# EAGLE design DoubleLna (EAGLE 9.6.2)
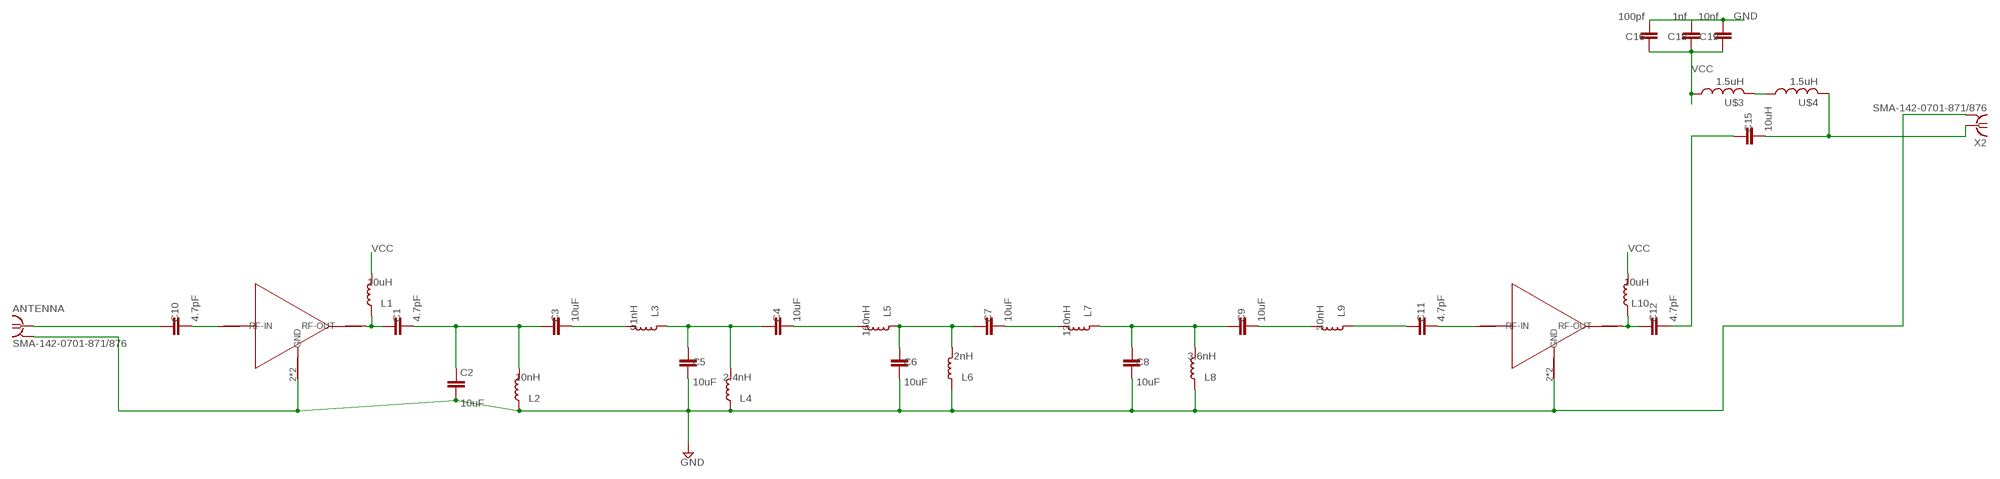
[diagram p0: schematic, sheet 1]

## Parts
ANTENNA  SMA-142-0701-871/876  [J502-ND-142-0701-871/876]
C1  4.7pF  10UF-0603-6.3V-20%  [0603]
C2  10uF  10UF-0603-6.3V-20%  [0603]
C3  10uF  10UF-0603-6.3V-20%  [0603]
C4  10uF  10UF-0603-6.3V-20%  [0603]
C5  10uF  10UF-0603-6.3V-20%  [0603]
C6  10uF  10UF-0603-6.3V-20%  [0603]
C7  10uF  10UF-0603-6.3V-20%  [0603]
C8  10uF  10UF-0603-6.3V-20%  [0603]
C9  10uF  10UF-0603-6.3V-20%  [0603]
C10  4.7pF  10UF-0603-6.3V-20%  [0603]
C11  4.7pF  10UF-0603-6.3V-20%  [0603]
C12  4.7pF  10UF-0603-6.3V-20%  [0603]
C15  10uH  10UF-0603-6.3V-20%  [0603]
C16  100pf  10UF-0603-6.3V-20%  [0603]
C18  1nf  10UF-0603-6.3V-20%  [0603]
C19  10nf  10UF-0603-6.3V-20%  [0603]
L1  10uH  L_0603  [L0603]
L2  10nH  L_0603  [L0603]
L3  91nH  L_0603  [L0603]
L4  2.4nH  L_0603  [L0603]
L5  160nH  L_0603  [L0603]
L6  2nH  L_0603  [L0603]
L7  130nH  L_0603  [L0603]
L8  3.6nH  L_0603  [L0603]
L9  30nH  L_0603  [L0603]
L10  10uH  L_0603  [L0603]
U$1  PSA4-5043+  [PSA4-5043+]
U$2  PSA4-5043+  [PSA4-5043+]
U$3  1.5uH  L504  [C0504]
U$4  1.5uH  L504  [C0504]
X2  SMA-142-0701-871/876  [J502-ND-142-0701-871/876]

## Nets
GND: ANTENNA.G@1 ANTENNA.G@2 ANTENNA.G@3 ANTENNA.G@4 C2.2 C5.2 C6.2 C8.2 C16.2 C18.2 C19.2 L2.2 L4.2 L6.2 L8.2 U$1.2(GND) U$1.4(GND) U$2.2(GND) U$2.4(GND) X2.G@1 X2.G@2 X2.G@3 X2.G@4
N$1: ANTENNA.1 C10.1
N$2: C1.2 C2.1 C3.1 L2.1
N$3: C3.2 L3.1
N$4: C4.1 C5.1 L3.2 L4.1
N$5: C4.2 L5.1
N$6: C6.1 C7.1 L5.2 L6.1
N$7: C7.2 L7.1
N$8: C8.1 C9.1 L7.2 L8.1
N$9: C9.2 L9.1
N$10: C10.2 U$1.3(RF-IN)
N$11: C1.1 L1.2 U$1.1(RF-OUT)
N$12: C12.1 L10.2 U$2.1(RF-OUT)
N$13: C11.2 U$2.3(RF-IN)
N$14: C12.2 C15.1
N$16: C11.1 L9.2
N$21: C15.2 U$4.2 X2.1
N$22: U$3.2 U$4.1
VCC: C16.1 C18.1 C19.1 L1.1 L10.1 U$3.1

## Library data of the parts
ANTENNA X2 = con-coax:SMA-: SMA 50 Ohm End Launch Jack Receptacle - Round Contact Johnson Components Source: www.johnsoncomponents.com .. J502-ND.pdf; MF: JOHNSON COMPONENTS; MPN: 142-0701-871; OC_FARNELL: 1339835; OC_NEWARK: 91B6105
C1 C10-C12 C15 C16 C18 C19 = SparkFun-Capacitors:10UF: 10.0µF ceramic capacitors A capacitor is a passive two-terminal electrical component used to store electrical energy temporarily in an electric field.; PROD_ID: CAP-11015; VALUE: 10uF
C2-C9 = SparkFun-Capacitors:10UF: 10.0µF ceramic capacitors A capacitor is a passive two-terminal electrical component used to store electrical energy temporarily in an electric field.; PROD_ID: CAP-11015
L1-L10 = rc-master-smd:L_: INDUCTOR
U$1 U$2 = PSA4-5043_:PSA4-5043+; AVAILABILITY: Unavailable; DESCRIPTION: Ultra Low Noise MMIC Amplifier, 50ohm, 0.05 to 4 GHz; MF: Mini-Circuits; MP: PSA4-5043+; PACKAGE: None; PRICE: None
U$3 U$4 = rcl-2:L504

## Net classes
0 default: width 0.305 mm, clearance 0.076 mm

## Board
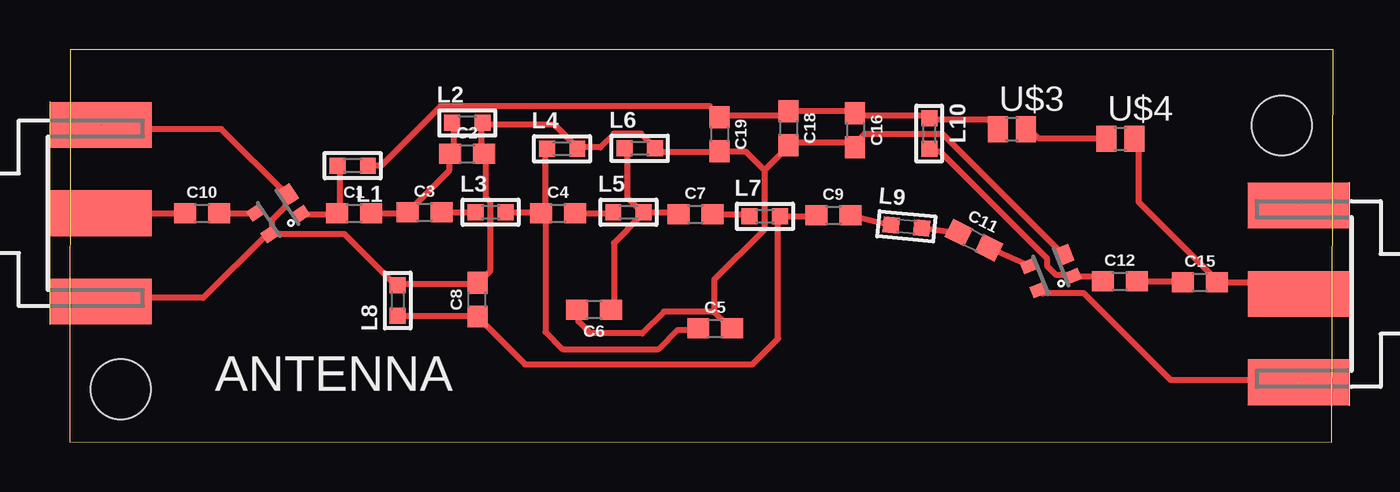
[diagram p1: board, top side]
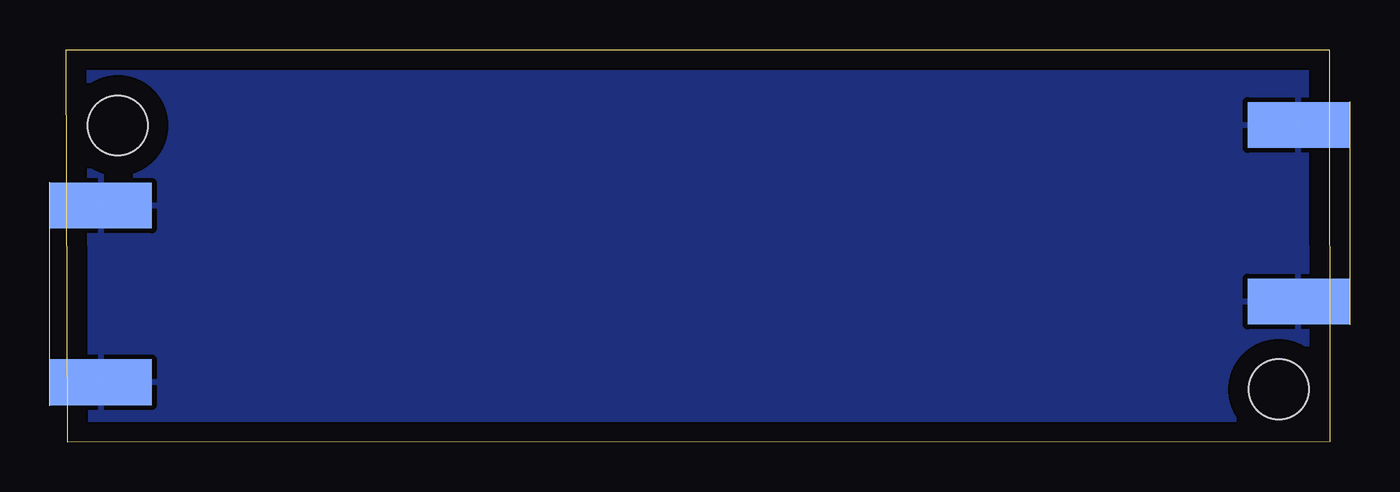
[diagram p2: board, bottom side, seen from below]

Size 63.3 x 19.63 mm. Coordinates in mm from the lower left corner, seen from the top.
Outline: 0,0.02 63.23,0 63.3,19.63 0.03,19.63 0,0.02
Copper layers (1*16): Top 0.035mm / dielectric 1.5mm / Bottom 0.035mm
Design rules "default": minimum track width 6mil, minimum drill 0.35mm, track to track 6mil, track to pad 6mil, pad to pad 6mil, via to via 6mil, smd to smd 6mil, copper to edge 40mil, drill to drill 6mil, minimum pad ring 10mil, minimum via ring 8mil, stop-mask expansion 4mil, vias tented up to drill 0mil, thermal gap 10mil
Holes 3 mm at 60.71,15.85 2.56,2.64

### Footprints (pad centres in the part's own frame; a part is rotated, then mirrored left to right if it is on the bottom)
J502-ND-142-0701-871/876 = smd 5.08 x 2.286: 1 2.565,0; G@1 2.565,4.42; G@2 2.565,-4.42 | smd 5.08 x 2.286 bottom: G@3 2.565,4.42; G@4 2.565,-4.42
0603 = smd 1.1 x 1: 1 -0.85,0; 2 0.85,0
L0603 = smd 0.8 x 0.8: 1 -0.762,0; 2 0.762,0
PSA4-5043+ = smd 0.6 x 0.8: 1 -0.65,-0.9; 3 0.65,0.9; 4 -0.65,0.9 | smd 0.9 x 0.8: 2 0.5,-0.9
C0504 = smd 1 x 1.3: 1 -0.7,0; 2 0.7,0

### Placement (x,y rotation side)
ANTENNA  -0.99,11.45 0 top
C1  14.25,11.45 0 top
C2  19.91,14.43 0 top
C3  17.78,11.51 0 top
C4  24.46,11.45 0 top
C5  32.33,5.69 0 top
C6  26.26,6.63 180 top
C7  31.34,11.4 0 top
C8  20.42,7.14 90 top
C9  38.25,11.35 0 top
C10  6.63,11.45 0 top
C11  45.29,10.11 333.7 top
C12  52.6,8.05 0 top
C15  56.62,8 0 top
C16  39.34,15.62 270 top
C18  35.99,15.72 270 top
C19  32.54,15.42 270 top
L1  14.17,13.84 180 top
L2  19.91,15.98 0 top
L3  21.08,11.51 0 top
L4  24.66,14.68 0 top
L5  27.99,11.51 0 top
L6  28.55,14.71 0 top
L7  34.82,11.3 0 top
L8  16.43,7.09 90 top
L9  41.91,10.79 354.6 top
L10  43.05,15.44 270 top
U$1  10.44,11.45 123.7 top
U$2  49.15,8.56 112 top
U$3  47.19,15.67 0 top
U$4  52.63,15.19 0 top
X2  64.11,7.42 180 top

### Tracks (layer width: path | path; a pad name or v marks a point on that pad's centre or on a via)
GND  (3 unrouted)
  Top 0.305: 25.43,14.76 26.57,14.76 27.25,15.44 28.62,15.44 29.31,14.76 L6.2 29.31,14.53 32.51,14.53 C19.2 32.74,14.53 33.88,14.53 34.8,13.61 | 25.43,14.76 24.28,15.9 20.85,15.9 L2.2 20.62,15.9 20.62,14.53 C2.2 20.85,14.3 20.85,12.24 21.08,12.01 21.08,8.59 20.62,8.13 C8.2 20.4,7.9 16.51,7.9 L8.2 16.28,7.9 13.77,10.41 10.11,10.41 U$1.4 | 25.43,14.76 L4.2 | 32.28,6.53 29.77,6.53 28.68,5.43 26.09,5.43 25.48,6.04 C6.2 | 32.28,6.53 32.97,5.84 C5.2 | U$2.2 49.66,9.5 43.71,15.44 39.83,15.44 39.37,14.99 C16.2 39.14,14.99 36.17,14.99 C18.2 35.94,14.76 34.8,13.61 | 32.28,6.53 32.28,8.13 34.8,10.64 34.8,13.61 | U$2.4 48.74,7.44 50.8,7.44 55.14,3.1 58.57,3.1 61.54,3.1 X2.G@3 | U$1.4 10.11,10.64 10.11,11.1 10.79,11.79 10.79,12.24 U$1.2 10.79,12.47 7.59,15.67 4.62,15.67 1.65,15.67 ANTENNA.G@3 | ANTENNA.G@4 1.65,7.21 6.68,7.21 9.88,10.41 U$1.4
  pour Bottom: -3.53,21.61 67.59,21.61 67.59,-2.52 -3.53,-2.52
N$1
  Top 0.305: ANTENNA.1 C10.1
N$2
  Top 0.305: C1.2 16.88,11.45 C3.1 16.97,11.56 19.02,13.61 19.02,14.3 C2.1 19.25,14.53 19.25,15.9 L2.1
N$3
  Top 0.305: C3.2 L3.1
N$4
  Top 0.305: L3.2 23.56,11.51 C4.1 | L4.1 23.82,14.53 23.82,11.56 C4.1 | C5.1 31.37,5.61 30.45,5.61 29.49,4.65 24.69,4.65 23.82,5.51 23.82,11.33 C4.1
N$5
  Top 0.305: C4.2 27.18,11.45 L5.1
N$6
  Top 0.305: L5.2 30.39,11.51 C7.1 | L6.1 27.94,14.53 27.94,12.24 28.62,11.56 L5.2 | C6.1 27.25,6.76 27.25,9.96 28.62,11.33 L5.2
N$7
  Top 0.305: C7.2 33.96,11.4 L7.1
N$8
  Top 0.305: C9.1 37.35,11.3 L7.2 35.48,11.1 35.48,5.18 34.19,3.89 22.81,3.89 20.62,6.07 C8.1 20.4,6.3 16.51,6.3 L8.1
N$9
  Top 0.305: C9.2 L9.1
N$10
  Top 0.305: C10.2 9.29,11.45 U$1.3
N$11
  Top 0.305: U$1.1 13.36,11.41 C1.1 13.54,11.56 13.54,13.84 L1.2
N$12
  Top 0.305: C12.1 51.51,8.29 U$2.1 50.11,8.36 49.43,8.36 48.97,8.81 48.97,9.17 43.61,14.53 43.26,14.53 L10.2
N$13
  Top 0.305: C11.2 U$2.3
N$14
  Top 0.305: C15.1 55.72,8.05 C12.2
N$16
  Top 0.305: 44.3,10.71 C11.1 L9.2
N$21
  Top 0.305: X2.1 60.96,8 C15.2 57.43,8.13 53.54,12.01 53.54,14.99 U$4.2
N$22
  Top 0.305: U$4.1 51.71,15.21 48.51,15.21 48.06,15.67 U$3.2
VCC
  Top 0.305: U$3.1 46.46,15.67 46,16.13 43.26,16.13 L10.1 43.03,16.36 39.37,16.36 C16.1 39.14,16.59 36.17,16.59 C18.1 35.94,16.36 32.74,16.36 C19.1 32.51,16.36 32.05,16.81 18.57,16.81 15.6,13.84 L1.1